# Altium schematic sheet Ethernet_0_V1_01.SchDoc
size A2; Date: Date; CompanyName: HESSO; Engineer: Name; Address1: Route du Rawyl 47; Address2: 1950 Sion; Address3: Switzerland; ProjectName: Project Name
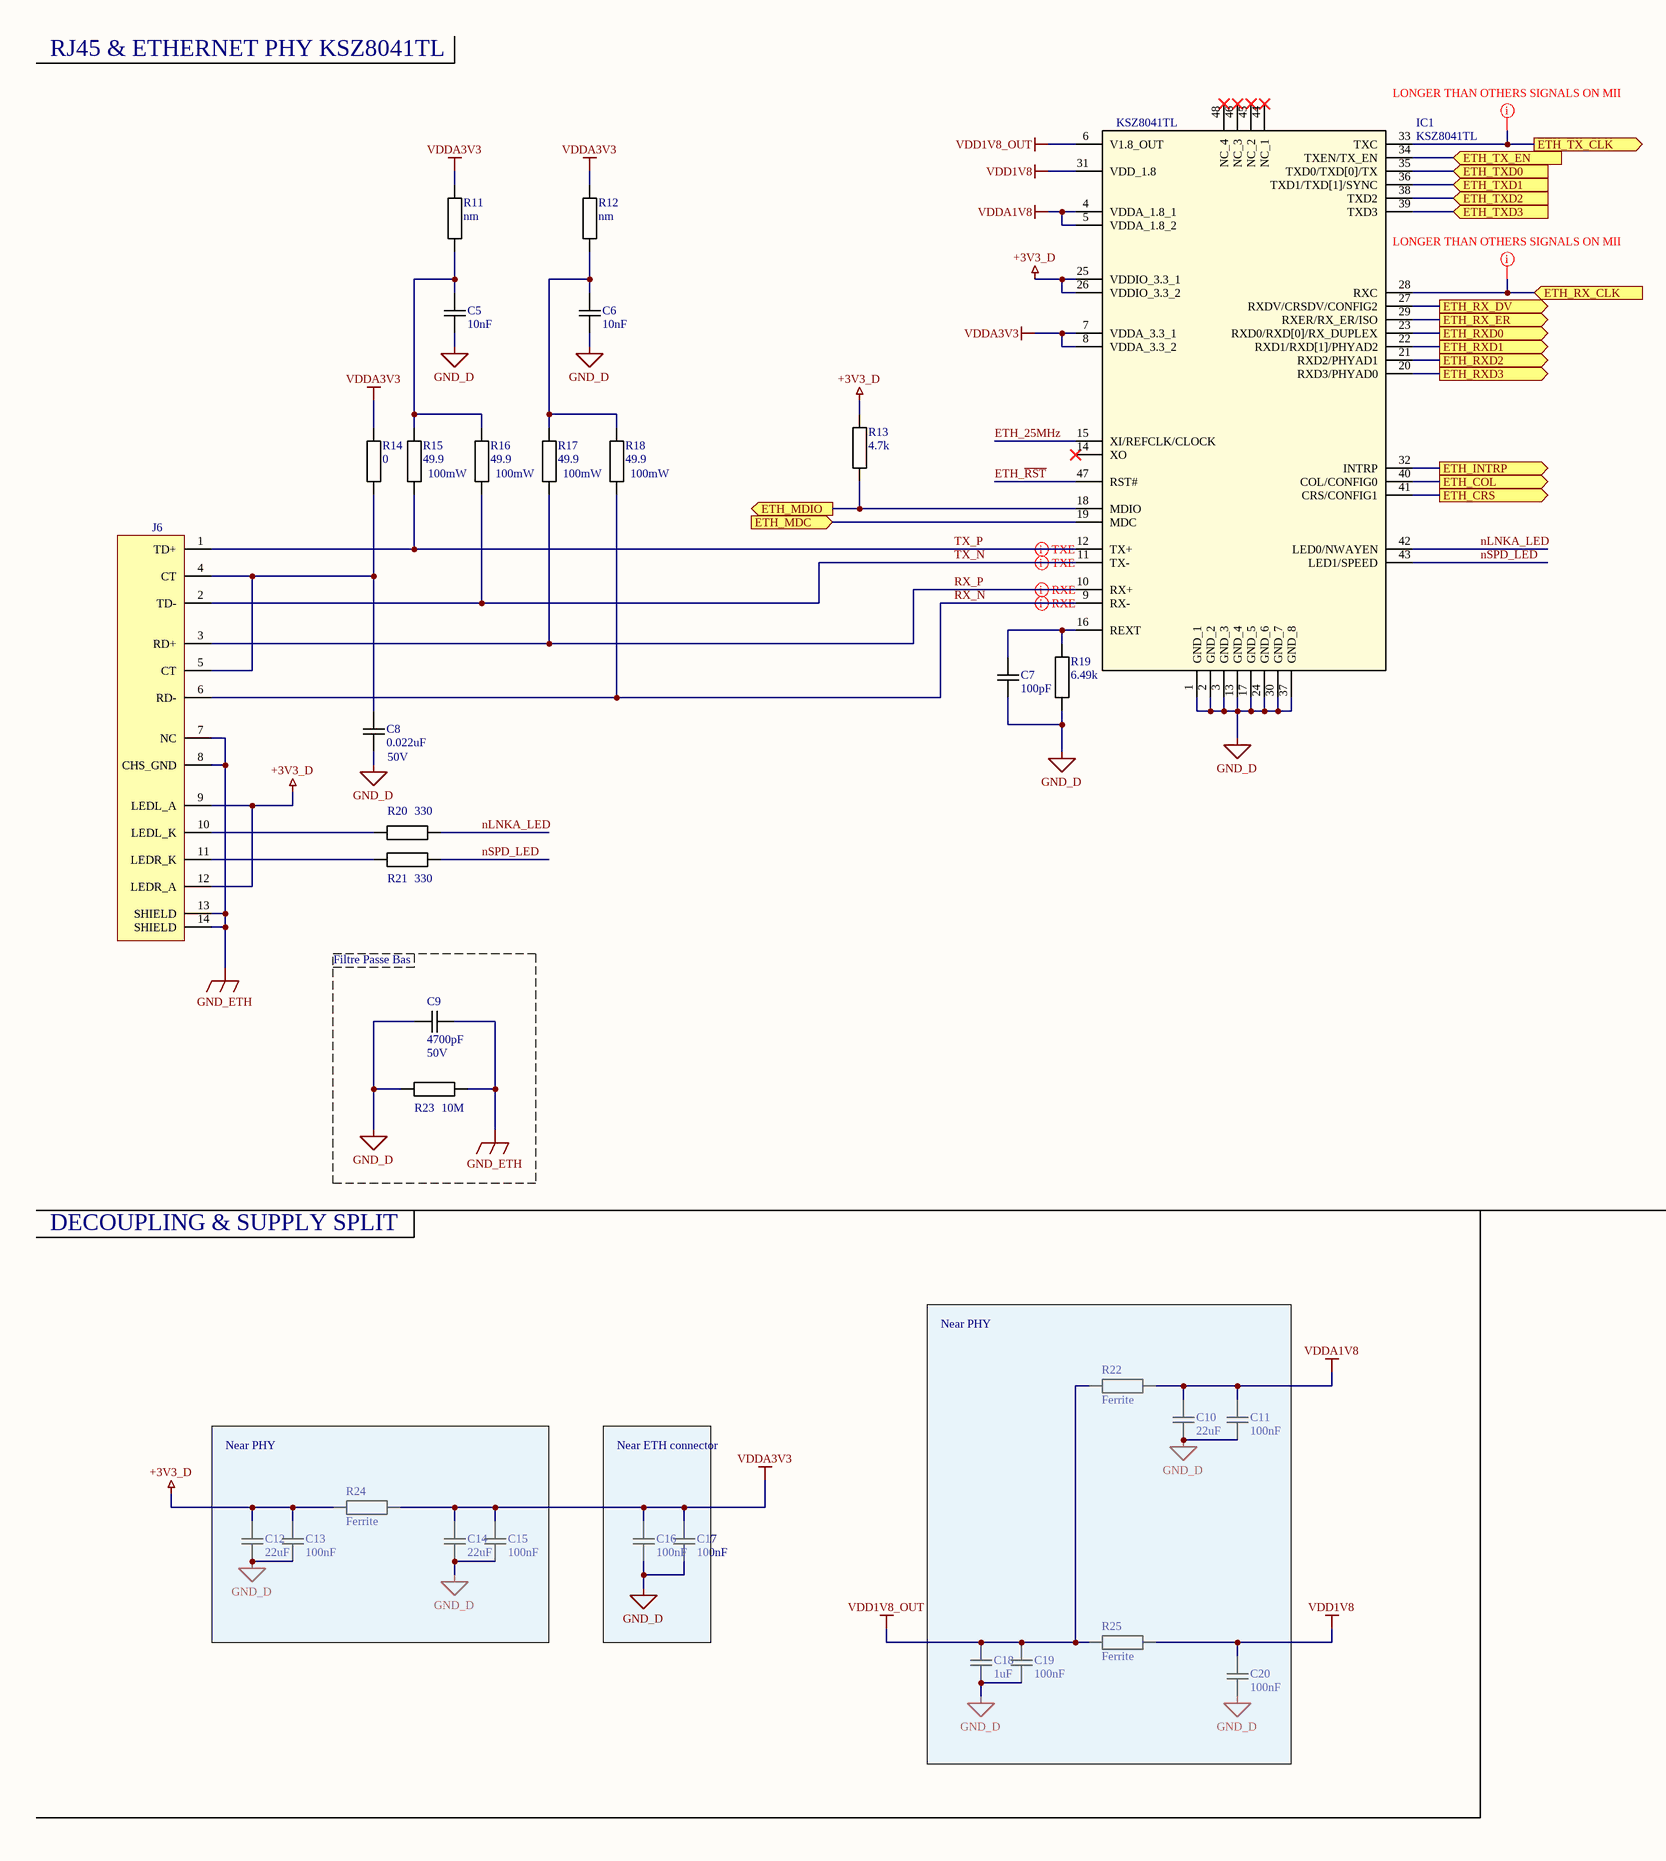
[diagram p0: Ethernet_0_V1_01.SchDoc, left]
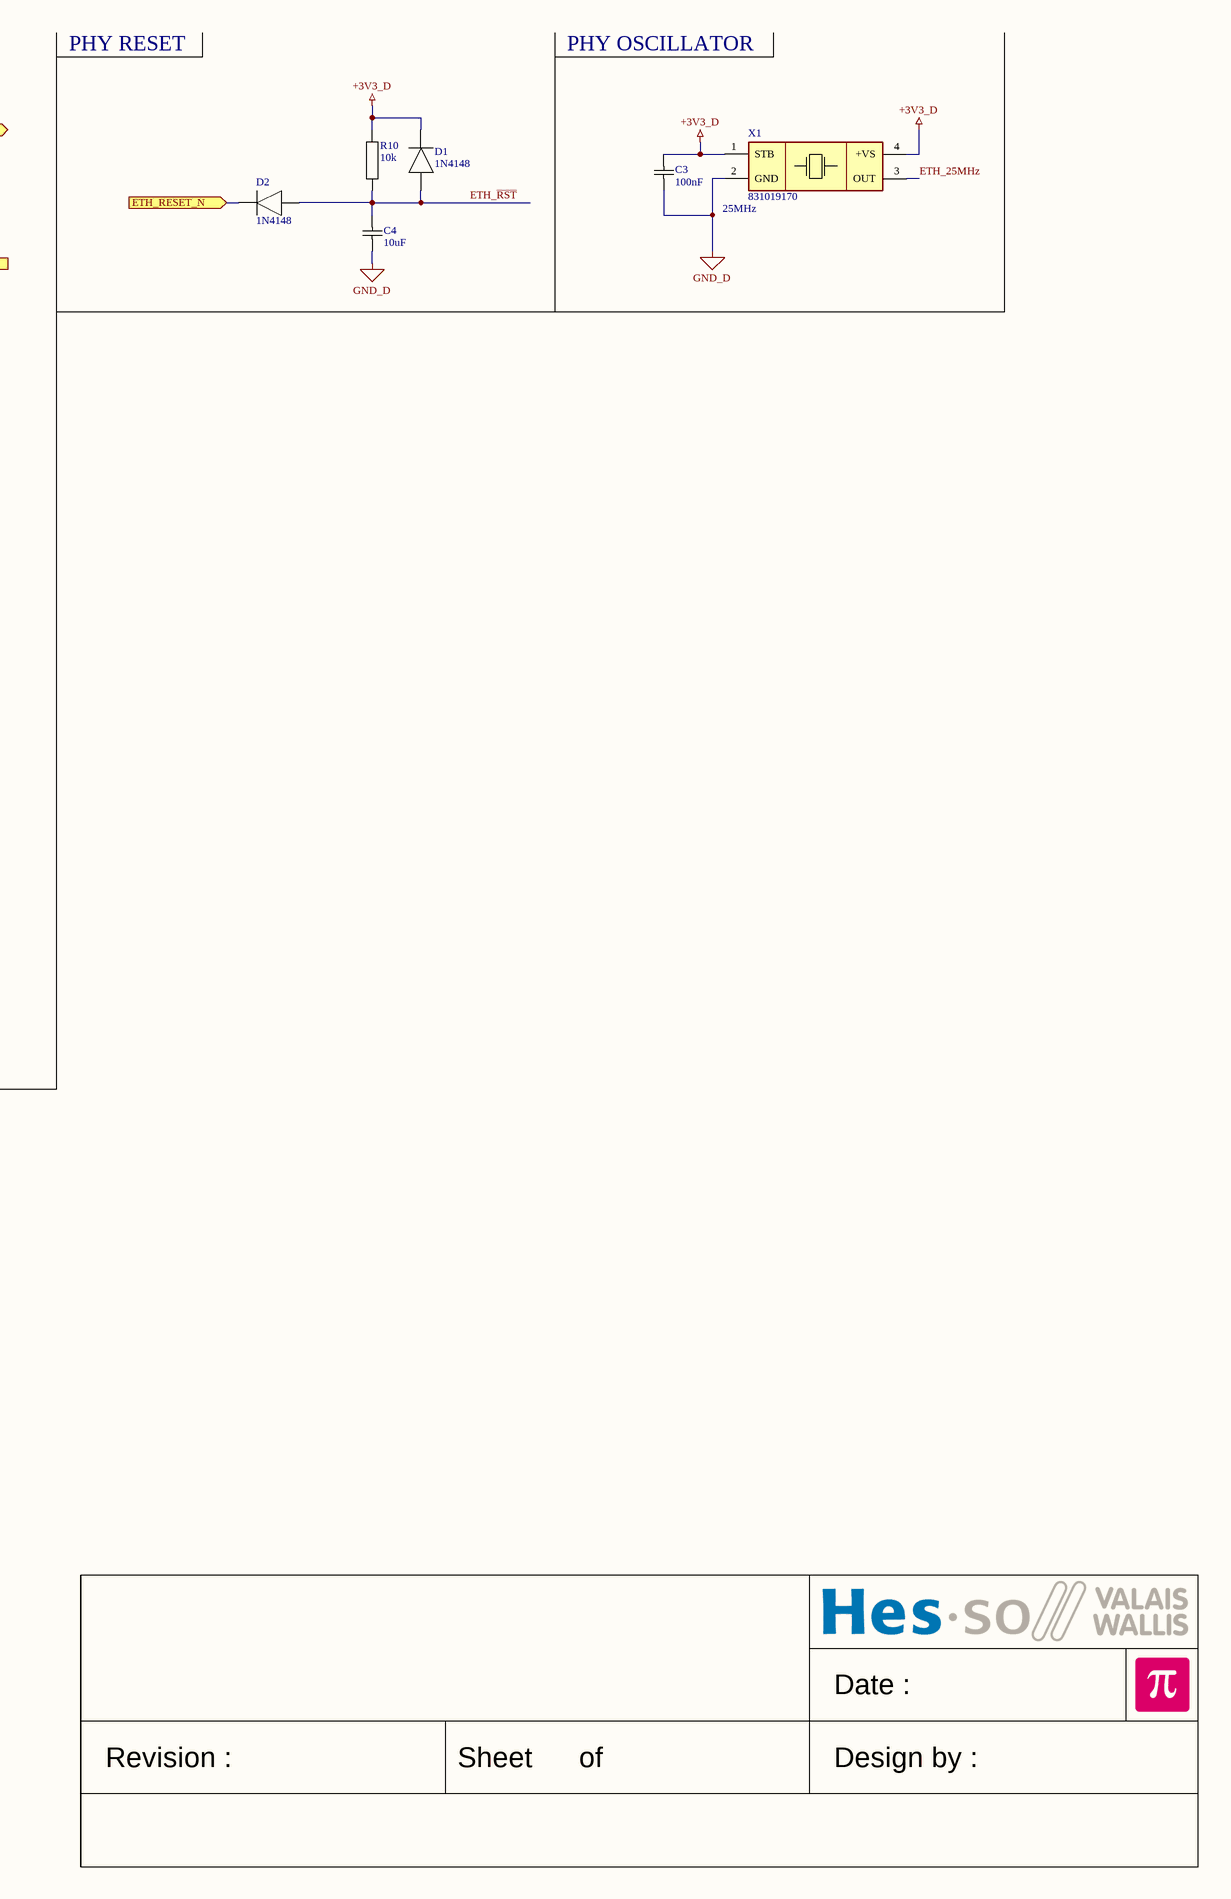
[diagram p1: Ethernet_0_V1_01.SchDoc, right]

## Parts
C3  100nF  [CAPACITOR 1608 REFLOW]
C4  10uF  [CAPACITOR 2012 REFLOW]
C5  10nF  [CAPACITOR 1608 REFLOW]
C6  10nF  [CAPACITOR 1608 REFLOW]
C7  100pF  [CAPACITOR 1608 REFLOW]
C8  0.022uF  V: 50V  [CAPACITOR 1608 REFLOW]
C9  4700pF  U: 50V  [CAPACITOR 1608 REFLOW]
C10  22uF  [CAPACITOR 2012 REFLOW]
C11  100nF  [CAPACITOR 1608 REFLOW]
C12  22uF  [CAPACITOR 2012 REFLOW]
C13  100nF  [CAPACITOR 1608 REFLOW]
C14  22uF  [CAPACITOR 2012 REFLOW]
C15  100nF  [CAPACITOR 1608 REFLOW]
C16  100nF  [CAPACITOR 1608 REFLOW]
C17  100nF  [CAPACITOR 1608 REFLOW]
C18  1uF  [CAPACITOR 2012 REFLOW]
C19  100nF  [CAPACITOR 1608 REFLOW]
C20  100nF  [CAPACITOR 1608 REFLOW]
D1  1N4148  [DIODE SOD323 REFLOW]
D2  1N4148  [DIODE SOD323 REFLOW]
IC1  KSZ8041TL  [QFP50P900X900X105-48N]
J6  RJ45-PULSE-J0011D21BNL  [RJ45 PULSE J0011D21BNL]  (value not drawn)
R10  10k  [RESISTOR 1608 REFLOW]
R11  nm  [RESISTOR 1608 REFLOW]
R12  nm  [RESISTOR 1608 REFLOW]
R13  4.7k  [RESISTOR 1608 REFLOW]
R14  0  [RESISTOR 1608 REFLOW]
R15  49.9  W: 100mW  [RESISTOR 1608 REFLOW]
R16  49.9  W: 100mW  [RESISTOR 1608 REFLOW]
R17  49.9  W: 100mW  [RESISTOR 1608 REFLOW]
R18  49.9  W: 100mW  [RESISTOR 1608 REFLOW]
R19  6.49k  [RESISTOR 1608 REFLOW]
R20  330  [RESISTOR 1608 REFLOW]
R21  330  [RESISTOR 1608 REFLOW]
R22  Ferrite  [RESISTOR 1608 REFLOW]
R23  10M  [RESISTOR 1608 REFLOW]
R24  Ferrite  [RESISTOR 1608 REFLOW]
R25  Ferrite  [RESISTOR 1608 REFLOW]
X1  831019170  Freq: 25MHz  [Oscillator C5.2x7.2 IQD LFSPXO]

## Blocks framed on the sheet
Filtre Passe Bas: C9 R23
Near PHY: C10 C11 C18-C20 R22 R25
Near PHY: C12-C15 R24
Near ETH connector: C16 C17

## Ports
ETH_COL (out), ETH_CRS (out), ETH_INTRP (out), ETH_MDC (in), ETH_MDIO (out), ETH_RESET_N (in), ETH_RX_CLK (in), ETH_RX_DV (out), ETH_RX_ER (out), ETH_RXD0 (out), ETH_RXD1 (out), ETH_RXD2 (out), ETH_RXD3 (out), ETH_TX_CLK (out), ETH_TX_EN (in), ETH_TXD0 (in), ETH_TXD1 (in), ETH_TXD2 (in), ETH_TXD3 (in)

## Nets
+3V3_D: C3.2 C12.2 C13.2 D1.1(C) IC1.25(VDDIO_3.3_1) IC1.26(VDDIO_3.3_2) J6.9(LEDL_A) J6.12(LEDR_A) R10.2 R13.2 R24.2 X1.1(STB) X1.4(+VS)
GND_D: C3.1 C4.1 C5.1 C6.1 C7.1 C8.2 C9.1 C10.1 C11.1 C12.1 C13.1 C14.1 C15.1 C16.1 C17.1 C18.1 C19.1 C20.1 IC1.1(GND_1) IC1.2(GND_2) IC1.3(GND_3) IC1.13(GND_4) IC1.17(GND_5) IC1.24(GND_6) IC1.30(GND_7) IC1.37(GND_8) R19.1 R23.2 X1.2(GND)
GND_ETH: C9.2 J6.7(NC) J6.8(CHS_GND) J6.13(SHIELD) J6.14(SHIELD) R23.1
VDD1V8: C20.2 IC1.31(VDD_1.8) R25.1
VDD1V8_OUT: C18.2 C19.2 IC1.6(V1.8_OUT) R22.2 R25.2
VDDA1V8: C10.2 C11.2 IC1.4(VDDA_1.8_1) IC1.5(VDDA_1.8_2) R22.1
VDDA3V3: C14.2 C15.2 C16.2 C17.2 IC1.7(VDDA_3.3_1) IC1.8(VDDA_3.3_2) R11.2 R12.2 R14.2 R24.1
ETH_25MHz: IC1.15(XI/REFCLK/CLOCK) X1.3(OUT)
ETH_COL: IC1.40(COL/CONFIG0) ; port ETH_COL
ETH_CRS: IC1.41(CRS/CONFIG1) ; port ETH_CRS
ETH_INTRP: IC1.32(INTRP) ; port ETH_INTRP
ETH_MDC: IC1.19(MDC) ; port ETH_MDC
ETH_MDIO: IC1.18(MDIO) R13.1 ; port ETH_MDIO
ETH_~{RST}: C4.2 D1.2(A) D2.2(A) IC1.47(RST#) R10.1
ETH_RESET_N: D2.1(C) ; port ETH_RESET_N
ETH_RX_CLK: IC1.28(RXC) ; port ETH_RX_CLK
ETH_RX_DV: IC1.27(RXDV/CRSDV/CONFIG2) ; port ETH_RX_DV
ETH_RX_ER: IC1.29(RXER/RX_ER/ISO) ; port ETH_RX_ER
ETH_RXD0: IC1.23(RXD0/RXD[0]/RX_DUPLEX) ; port ETH_RXD0
ETH_RXD1: IC1.22(RXD1/RXD[1]/PHYAD2) ; port ETH_RXD1
ETH_RXD2: IC1.21(RXD2/PHYAD1) ; port ETH_RXD2
ETH_RXD3: IC1.20(RXD3/PHYAD0) ; port ETH_RXD3
ETH_TX_CLK: IC1.33(TXC) ; port ETH_TX_CLK
ETH_TX_EN: IC1.34(TXEN/TX_EN) ; port ETH_TX_EN
ETH_TXD0: IC1.35(TXD0/TXD[0]/TX) ; port ETH_TXD0
ETH_TXD1: IC1.36(TXD1/TXD[1]/SYNC) ; port ETH_TXD1
ETH_TXD2: IC1.38(TXD2) ; port ETH_TXD2
ETH_TXD3: IC1.39(TXD3) ; port ETH_TXD3
nLNKA_LED: IC1.42(LED0/NWAYEN) R20.1
nSPD_LED: IC1.43(LED1/SPEED) R21.1
RX_N: IC1.9(RX-) J6.6(RD-) R18.1
RX_P: IC1.10(RX+) J6.3(RD+) R17.1
TX_N: IC1.11(TX-) J6.2(TD-) R16.1
TX_P: IC1.12(TX+) J6.1(TD+) R15.1
NetC5_2: C5.2 R11.1 R15.2 R16.2
NetC6_2: C6.2 R12.1 R17.2 R18.2
NetC7_2: C7.2 IC1.16(REXT) R19.2
NetC8_1: C8.1 J6.4(CT) J6.5(CT) R14.1
NetJ6_10: J6.10(LEDL_K) R20.2
NetJ6_11: J6.11(LEDR_K) R21.2

Not connected (* = marked no-connect by the designer): IC1 14(XO)* 44(NC_1)* 45(NC_2)* 46(NC_3)* 48(NC_4)*

## Layout directives
mark named LONGER THAN OTHERS SIGNALS ON MII: ETH_RX_CLK, ETH_TX_CLK
differential pair: RX_N, RX_P, TX_N, TX_P

## Notes on the sheet
- RJ45 & ETHERNET PHY KSZ8041TL
- PHY RESET
- PHY OSCILLATOR
- DECOUPLING & SUPPLY SPLIT
- Date :
- Revision :
- Sheet
- of
- Design by :

## Library data of the parts
C3-C7 C10-C20 = Capacitor: Capacitor X7R 10% 50V 1608(0603)
  C3 C11 C13 C15-C17 C19 C20: Value: 100nF
  C4: Value: 10uF
  C5 C6: Value: 10nF
  C7: Value: 100pF
  C10 C12 C14: Value: 22uF
  C18: Value: 1uF
C8 C9 = Capacitor: Socket: 1005
  C8: Value: 0.022uF
  C9: Value: 4700pF
D1 D2 = DIODE: Diode generic 2 leads; Value: 1N4148
IC1 = KSZ8041TL: Integrated Circuit; Manufacturer_Name: Microchip; Datasheet Link: http://www.microchip.com/mymicrochip/filehandler.aspx?ddocname=en581559; Height: 1.05mm; Manufacturer_Part_Number: KSZ8041TL; Mouser Part Number: 998-KSZ8041TL; Mouser Price/Stock: https://www.mouser.co.uk/ProductDetail/Microchip-Technology-Micrel/KSZ8041TL?qs=kh6iOki%2FeLG3fBvp35yNQw%3D%3D; Arrow Part Number: KSZ8041TL; Arrow Price/Stock: https://www.arrow.com/en/products/ksz8041tl/microchip-technology
J6 = RJ45 PULSE J0011D21BNL: Integrated connector modules 10/100 base-TX belMag with LEDs; Value: RJ45-PULSE-J0011D21BNL; Supplier 1: Mouser; Supplier Part Number 1: 673-J0011D21BNL
R10 R13 R19 R22 R24 R25 = Resistor: Resistor 1% 50V 100mW 1608(0603)
  R10: Value: 10k
  R13: Value: 4.7k
  R19: Value: 6.49k
  R22 R24 R25: Value: Ferrite
R11 R12 R14-R18 R23 = Resistor
  R11 R12: Value: nm
  R14: Socket: 1005; Value: 0
  R15-R18: Value: 49.9; Socket: 1608
  R23: Value: 10M; Socket: 1005
R20 R21 = Resistor: W: 100mW; Value: 330
X1 = Oscillator C5.2x7.2 IQD LFSPXO: Value: 831019170